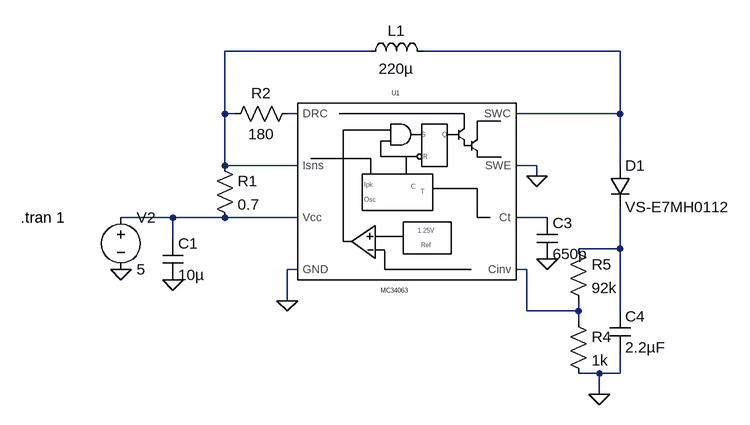
[diagram p0: schematic boost.asc]
boost.asc, the LTspice schematic file:
Version 4
SHEET 1 896 884
WIRE 240 336 16 336
WIRE 624 336 320 336
WIRE 16 432 16 336
WIRE 32 432 16 432
WIRE 128 432 112 432
WIRE 624 432 624 336
WIRE 624 432 464 432
WIRE 16 512 16 432
WIRE 128 512 16 512
WIRE 496 512 464 512
WIRE 624 512 624 432
WIRE 496 528 496 512
WIRE -64 592 -144 592
WIRE 16 592 -64 592
WIRE 128 592 16 592
WIRE 512 592 464 592
WIRE -64 624 -64 592
WIRE 624 640 624 576
WIRE 624 640 560 640
WIRE 128 672 112 672
WIRE 480 672 464 672
WIRE 112 720 112 672
WIRE 480 736 480 672
WIRE 560 736 560 720
WIRE 560 736 480 736
WIRE 624 736 624 640
WIRE 560 752 560 736
WIRE 592 832 560 832
WIRE 624 832 624 800
WIRE 624 832 592 832
WIRE 592 864 592 832
FLAG 496 528 0
FLAG 112 720 0
FLAG -144 672 0
FLAG 512 656 0
FLAG 592 864 0
FLAG -64 688 0
SYMBOL ind 224 352 R270
WINDOW 0 32 56 VTop 2
WINDOW 3 5 56 VBottom 2
SYMATTR InstName L1
SYMATTR Value 220µ
SYMBOL voltage -144 576 R0
WINDOW 123 0 0 Left 0
WINDOW 39 0 0 Left 0
SYMATTR InstName V2
SYMATTR Value 5
SYMBOL diode 608 512 R0
SYMATTR InstName D1
SYMATTR Value VS-E7MH0112
SYMBOL mc34063 368 528 R0
SYMATTR InstName U1
SYMATTR SpiceModel C:\users\dmytro\Documents\projects\RP_Nixie\HW\mc34063\MC34063_buck.asc
SYMBOL res 0 496 R0
SYMATTR InstName R1
SYMATTR Value 0.7
SYMBOL res 128 416 R90
WINDOW 0 0 56 VBottom 2
WINDOW 3 32 56 VTop 2
SYMATTR InstName R2
SYMATTR Value 180
SYMBOL cap 496 592 R0
SYMATTR InstName C3
SYMATTR Value 650p
SYMBOL cap 608 736 R0
SYMATTR InstName C4
SYMATTR Value 2.2µF
SYMBOL res 544 736 R0
SYMATTR InstName R4
SYMATTR Value 1k
SYMBOL res 544 624 R0
SYMATTR InstName R5
SYMATTR Value 92k
SYMBOL cap -80 624 R0
SYMATTR InstName C1
SYMATTR Value 10µ
TEXT -298 592 Left 2 !.tran 1

The netlist it stands for:
* boost.asc
L1 N001 N002 220µ
V2 N004 0 5
D1 N002 N006 VS-E7MH0112
XU1 N002 0 N005 0 N007 N004 N001 N003 C:\users\dmytro\Documents\projects\RP_Nixie\HW\mc34063\MC34063_buck.asc MC34063  ; pins SWC SWE Ct GND Cinv Vcc Isns DRC
R1 N001 N004 0.7
R2 N003 N001 180
C3 N005 0 650p
C4 N006 0 2.2µF
R4 N007 0 1k
R5 N006 N007 92k
C1 N004 0 10µ
.model D D
.lib standard.dio
.tran 1
.backanno
.end